# EAGLE schematic humidity_sensor_parts (EAGLE 6.4)
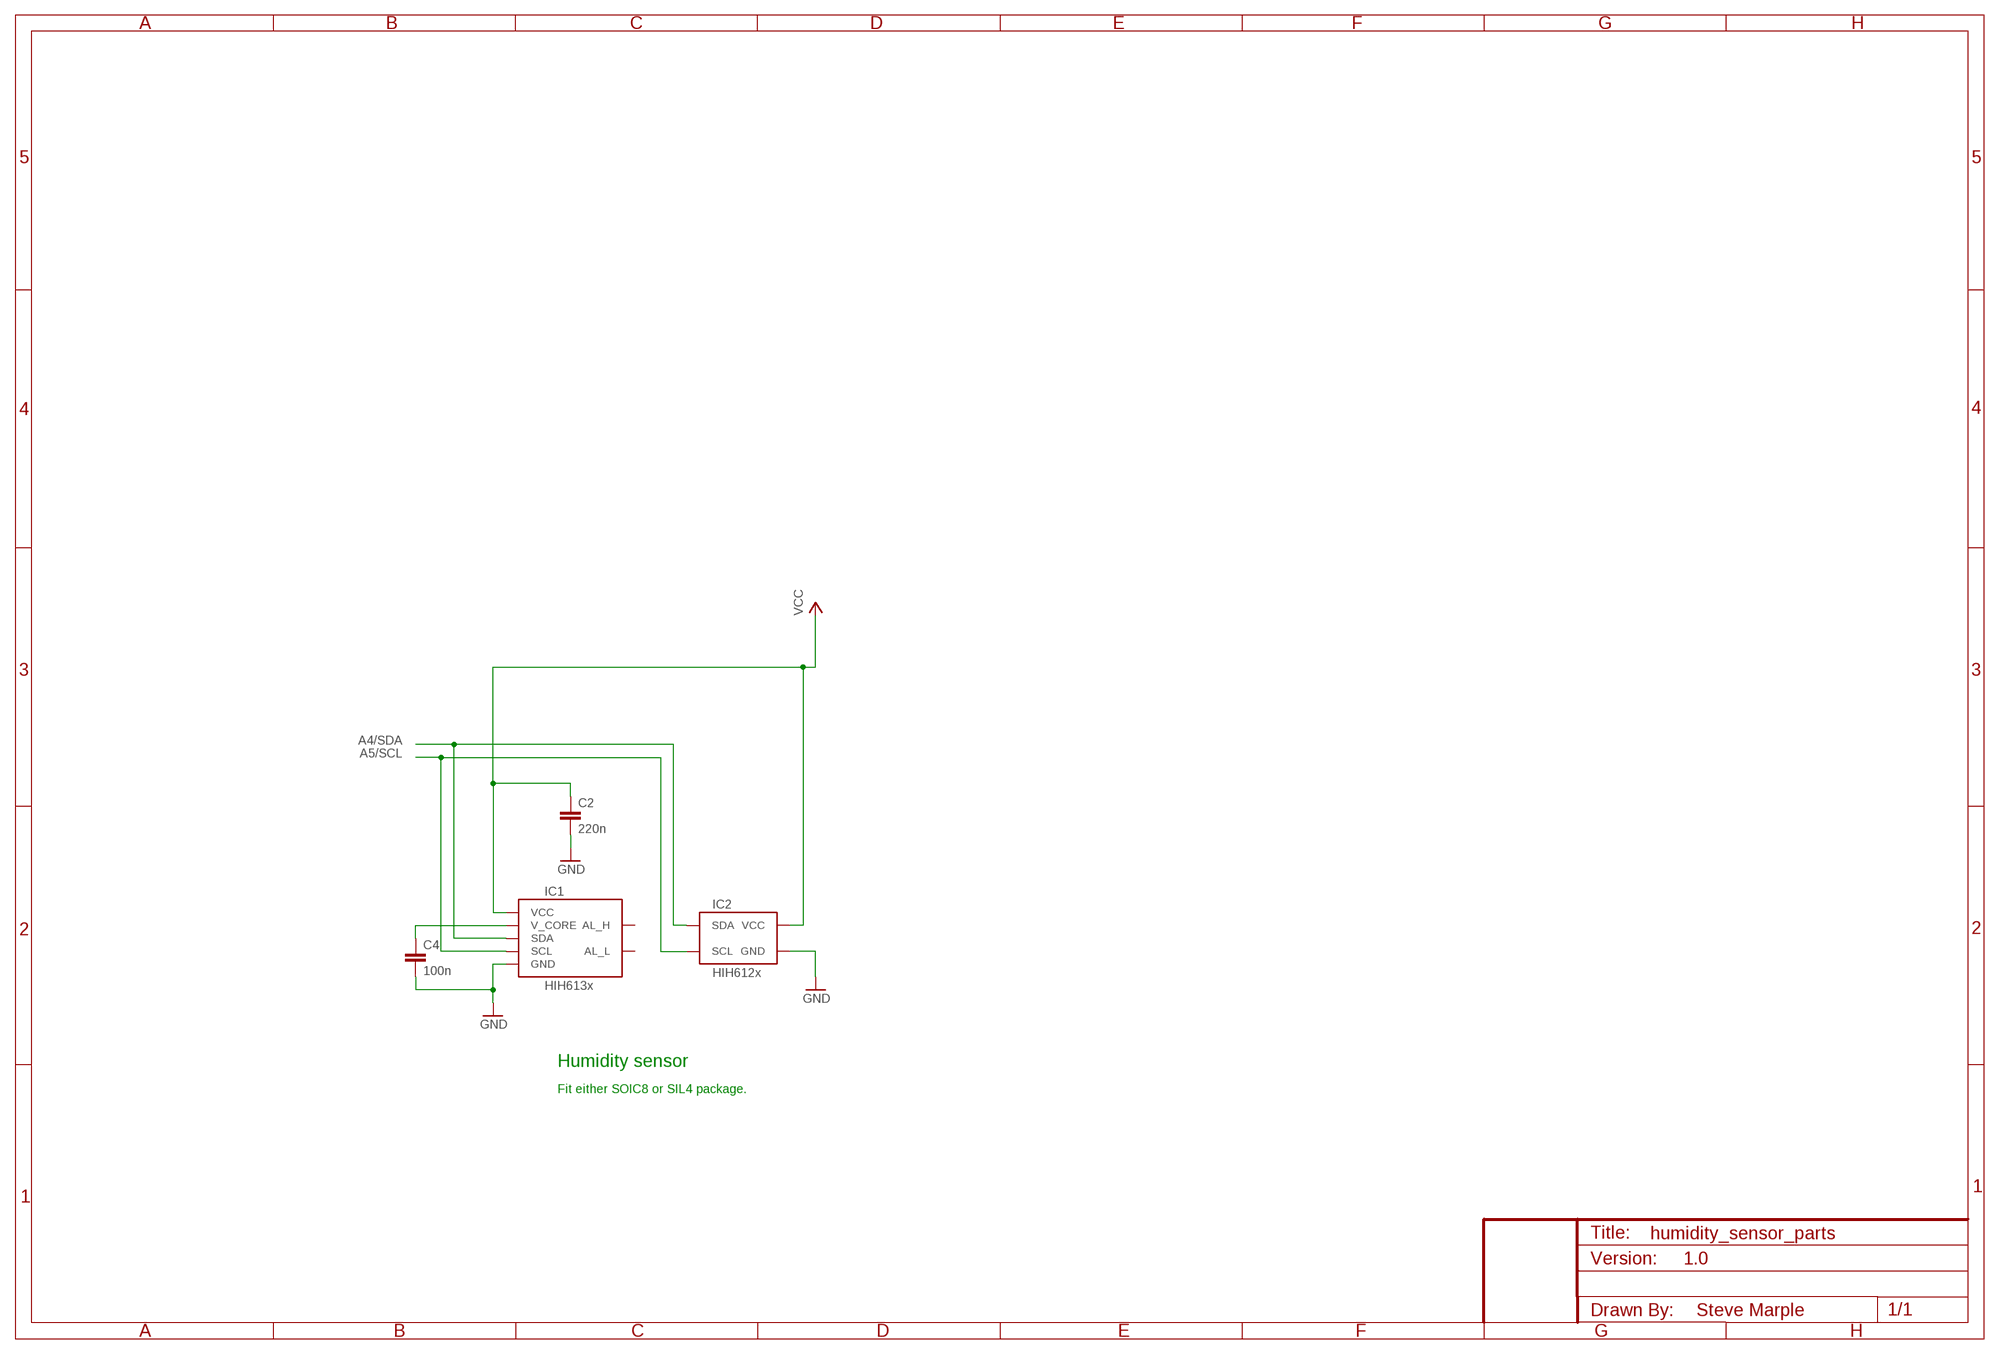
[diagram p0: schematic, sheet 1]
FRAME1 (FRAME-A3): VERSION: 1.0

## Parts
C2  220n  CAPPTH  [CAP-PTH-SMALL]
C4  100n  CAPPTH  [CAP-PTH-SMALL]
IC1  HIH613x  HONEYWELL-HIH613XSOIC8  [SO08]
IC2  HIH612x  HONEYWELL-HIH612X  [SIL04]

## Nets
A4/SDA: IC1.4(SDA) IC2.4(SDA)
A5/SCL: IC1.3(SCL) IC2.3(SCL)
GND [power]: C2.2 C4.2 IC1.2(GND) IC2.2(GND)
V_CORE [power]: C4.1 IC1.1(V_CORE)
VCC [power]: C2.1 IC1.8(VCC) IC2.1(VCC)
Unconnected: IC1.5(AL_H) IC1.6(AL_L)

## Notes on the sheet
- Humidity sensor
- Fit either SOIC8 or SIL4 package.
- 1.0
- Steve Marple

## Library data of the parts
C2 C4 = SparkFun:CAP: Capacitor Standard 0603 ceramic capacitor, and 0.1" leaded capacitor.
IC1 = SteveMarple:HONEYWELL-HIH613X
IC2 = SteveMarple:HONEYWELL-HIH612X

## Net classes
1 power: width 0.381 mm